# Altium schematic sheet CPU - LCD.SchDoc: Title
size Tabloid; Revision: A; ProjectTitle: CDU: CAN Display Unit
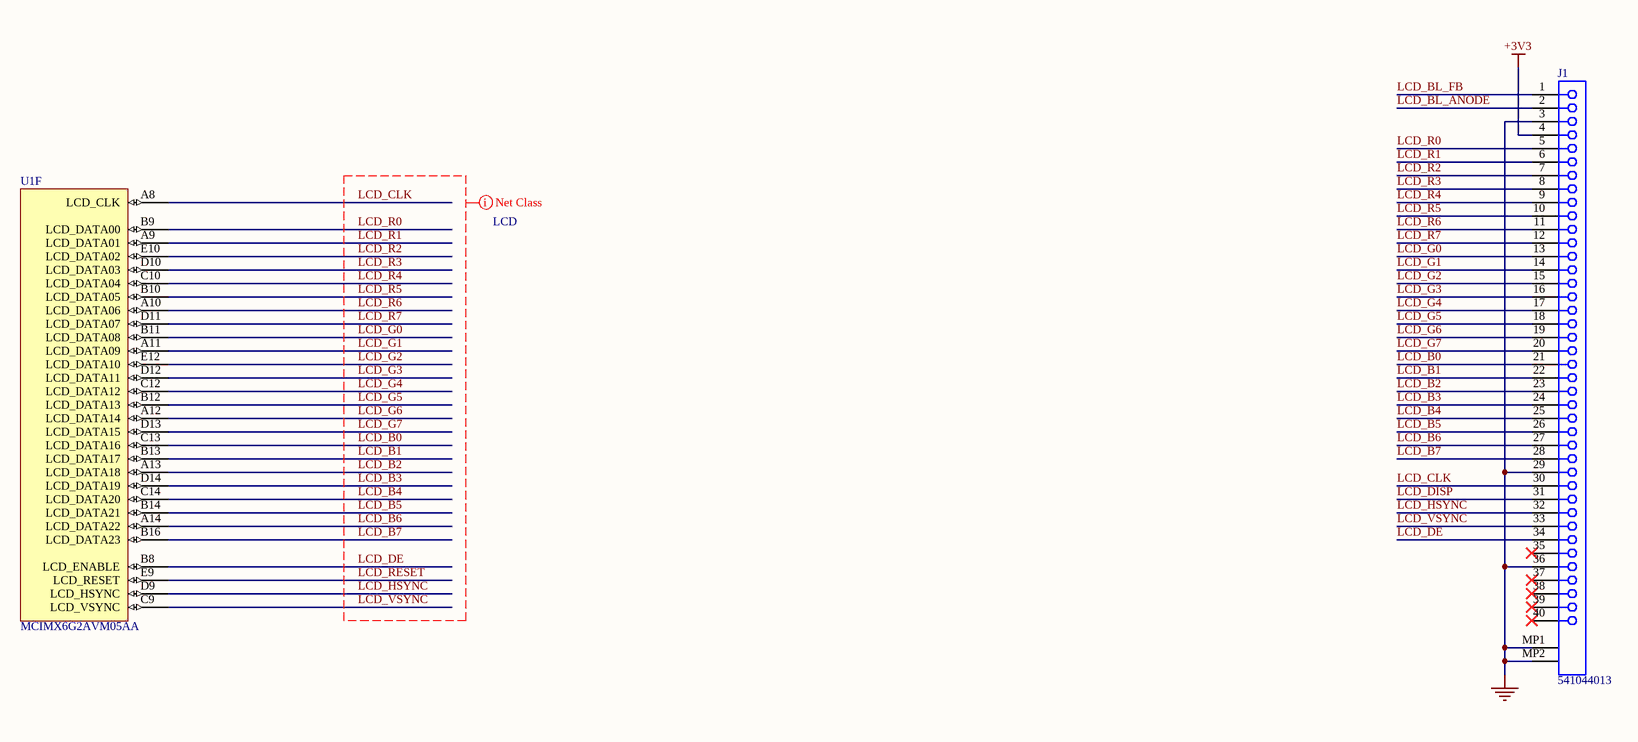
[diagram p0: CPU - LCD.SchDoc]

## Parts
J1  541044013  [MOLX-54104-4031]
U1  MCIMX6G2AVM05AA  [BGA289C80P17X17_1400X1400X132]  (part F of 14)

## Nets
+3V3: J1.4
GND: J1.3 J1.29 J1.36 J1.MP1 J1.MP2
LCD_B0: J1.21 U1.C13(LCD_DATA16)
LCD_B1: J1.22 U1.B13(LCD_DATA17)
LCD_B2: J1.23 U1.A13(LCD_DATA18)
LCD_B3: J1.24 U1.D14(LCD_DATA19)
LCD_B4: J1.25 U1.C14(LCD_DATA20)
LCD_B5: J1.26 U1.B14(LCD_DATA21)
LCD_B6: J1.27 U1.A14(LCD_DATA22)
LCD_B7: J1.28 U1.B16(LCD_DATA23)
LCD_BL_ANODE: J1.2
LCD_BL_FB: J1.1
LCD_CLK: J1.30 U1.A8(LCD_CLK)
LCD_DE: J1.34 U1.B8(LCD_ENABLE)
LCD_DISP: J1.31
LCD_G0: J1.13 U1.B11(LCD_DATA08)
LCD_G1: J1.14 U1.A11(LCD_DATA09)
LCD_G2: J1.15 U1.E12(LCD_DATA10)
LCD_G3: J1.16 U1.D12(LCD_DATA11)
LCD_G4: J1.17 U1.C12(LCD_DATA12)
LCD_G5: J1.18 U1.B12(LCD_DATA13)
LCD_G6: J1.19 U1.A12(LCD_DATA14)
LCD_G7: J1.20 U1.D13(LCD_DATA15)
LCD_HSYNC: J1.32 U1.D9(LCD_HSYNC)
LCD_R0: J1.5 U1.B9(LCD_DATA00)
LCD_R1: J1.6 U1.A9(LCD_DATA01)
LCD_R2: J1.7 U1.E10(LCD_DATA02)
LCD_R3: J1.8 U1.D10(LCD_DATA03)
LCD_R4: J1.9 U1.C10(LCD_DATA04)
LCD_R5: J1.10 U1.B10(LCD_DATA05)
LCD_R6: J1.11 U1.A10(LCD_DATA06)
LCD_R7: J1.12 U1.D11(LCD_DATA07)
LCD_RESET: U1.E9(LCD_RESET)
LCD_VSYNC: J1.33 U1.C9(LCD_VSYNC)

Not connected (* = marked no-connect by the designer): J1 35* 37* 38* 39* 40*

## Layout directives
net class LCD: LCD_B0, LCD_B1, LCD_B2, LCD_B3, LCD_B4, LCD_B5, LCD_B6, LCD_B7, LCD_CLK, LCD_DE, LCD_G0, LCD_G1, LCD_G2, LCD_G3, LCD_G4, LCD_G5, LCD_G6, LCD_G7, LCD_HSYNC, LCD_R0, LCD_R1, LCD_R2, LCD_R3, LCD_R4, LCD_R5, LCD_R6, LCD_R7, LCD_RESET, LCD_VSYNC

## Notes on the sheet
- Date:
- Revision:
- Sheet:
- /

## Library data of the parts
J1 = MOLX-54104-4031